# Altium schematic sheet Sheet1.SchDoc
size A4
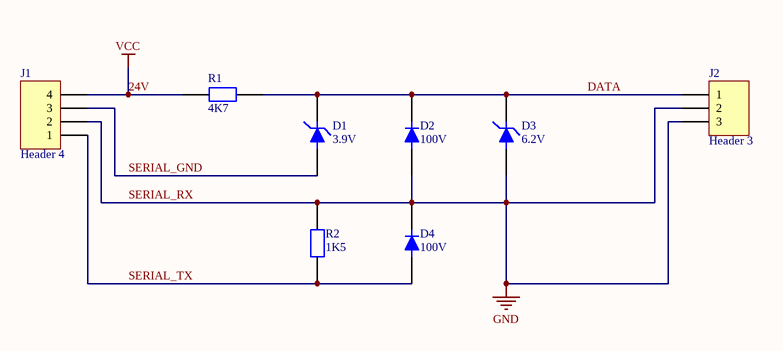
[diagram p0: Sheet1.SchDoc]

## Parts
D1  3.9V  [SOT23]
D2  100V  [SOT23]
D3  6.2V  [SOT23]
D4  100V  [SOT23]
J1  Header 4  [HDR1X4]
J2  Header 3  [PH_TERM_3]
R1  4K7  [RESC1608]
R2  1K5  [RESC1608]

## Nets
24V: J1.4 R1.1  [also labelled VCC]
SERIAL_RX: D2.1 D3.1 D4.3 J1.2 J2.2 J2.3 R2.2  [also labelled GND]
DATA: D1.3 D2.3 D3.3 J2.1 R1.2
SERIAL_GND: D1.1 J1.3
SERIAL_TX: D4.1 J1.1 R2.1

## Library data of the parts
D1 = BZX84C3V9LT1G: DIODE ZENER 3.9V 225MW SOT23-3; Manufacturer: ON Semiconductor; Tolerance: ±5%; Impedance (Max) (Zzt): 90 Ohm; Current - Reverse Leakage @ Vr: 3µA @ 1V; Voltage - Forward (Vf) (Max) @ If: 900mV @ 10mA; Supplier 1: Digi-Key; Manufacturer Part Number: BZX84C3V9LT1G; RoHS: RoHS Compliant; Category: Discrete Semiconductor Products; Stock 1: 20137; Pricing 1: 1=0.21, 10=0.188, 25=0.1708, 100=0.1232, 250=0.07256, 500=0.0602, 1000=0.04106 (AUD); Packaging: Cut Tape (CT); Voltage - Zener (Nom) (Vz): 3.9V; Power - Max: 225mW; Operating Temperature: -; Mounting Type: Surface Mount; Package / Case: TO-236-3, SC-59, SOT-23-3; Supplier Device Package: SOT-23-3 (TO-236); ComponentLink1URL: http://www.onsemi.com/pub_link/Collateral/BZX84C2V4LT1-D.PDF; ComponentLink1Description: http://www.onsemi.com/pub_link/Collateral/BZX84C2V4LT1-D.PDF; Supplier Part Number 1: BZX84C3V9LT1GOSCT-ND
D2 D4 = BAR46FILM: DIODE SCHOTTKY 100V 150MA SOT23; Manufacturer: STMicroelectronics; Current - Average Rectified (Io): 150mA (DC); Voltage - Forward (Vf) (Max) @ If: 1V @ 250mA; Speed: Small Signal =< 200mA (Io), Any Speed; Current - Reverse Leakage @ Vr: 5µA @ 75V; Capacitance @ Vr, F: 10pF @ 0V, 1MHz; Supplier 1: Digi-Key; Manufacturer Part Number: BAR46FILM; RoHS: RoHS Compliant; Category: Discrete Semiconductor Products; Stock 1: 2235; Pricing 1: 1=0.51, 10=0.296, 100=0.1274, 1000=0.09727 (AUD); Packaging: Digi-Reel®; Diode Type: Schottky; Voltage - DC Reverse (Vr) (Max): 100V; Reverse Recovery Time (trr): -; Mounting Type: Surface Mount; Package / Case: TO-236-3, SC-59, SOT-23-3; Supplier Device Package: SOT-23; Operating Temperature - Junction: 150°C (Max); ComponentLink1URL: http://www.st.com/web/en/resource/technical/document/datasheet/CD00000669.pdf; ComponentLink1Description: http://www.st.com/web/en/resource/technical/document/datasheet/CD00000669.pdf; Supplier Part Number 1: 497-12128-6-ND
D3 = BZX84C6V2LT1G: DIODE ZENER 6.2V 225MW SOT23-3; Manufacturer: ON Semiconductor; Tolerance: ±6%; Impedance (Max) (Zzt): 10 Ohm; Current - Reverse Leakage @ Vr: 3µA @ 4V; Voltage - Forward (Vf) (Max) @ If: 900mV @ 10mA; Supplier 1: Digi-Key; Manufacturer Part Number: BZX84C6V2LT1G; RoHS: RoHS Compliant; Category: Discrete Semiconductor Products; Stock 1: 23496; Pricing 1: 1=0.21, 10=0.188, 25=0.1708, 100=0.1232, 250=0.07256, 500=0.0602, 1000=0.04106 (AUD); Packaging: Cut Tape (CT); Voltage - Zener (Nom) (Vz): 6.2V; Power - Max: 225mW; Operating Temperature: -; Mounting Type: Surface Mount; Package / Case: TO-236-3, SC-59, SOT-23-3; Supplier Device Package: SOT-23-3 (TO-236); ComponentLink1URL: http://www.onsemi.com/pub_link/Collateral/BZX84C2V4LT1-D.PDF; ComponentLink1Description: http://www.onsemi.com/pub_link/Collateral/BZX84C2V4LT1-D.PDF; Supplier Part Number 1: BZX84C6V2LT1GOSCT-ND
J1 = Header 4: Header, 4-Pin; LatestRevisionDate: 17-Jul-2002; LatestRevisionNote: Re-released for DXP Platform.; Publisher: Altium Limited
J2 = Header 3: Header, 3-Pin; LatestRevisionDate: 17-Jul-2002; LatestRevisionNote: Re-released for DXP Platform.; Publisher: Altium Limited
R1 = RC0603FR-074K7L: RES SMD 4.7K OHM 1% 1/10W 0603; Manufacturer: Yageo; Power (Watts): 0.1W, 1/10W; Temperature Coefficient: ±100ppm/°C; Supplier 1: Digi-Key; Manufacturer Part Number: RC0603FR-074K7L; RoHS: RoHS Compliant; Category: Resistors; Stock 1: 3770438; Pricing 1: 1=0.15, 10=0.021, 25=0.0148, 100=0.0084, 250=0.0064, 500=0.0051, 1000=0.00377, 2500=0.00327 (AUD); Packaging: Cut Tape (CT); Resistance (Ohms): 4.7k; Tolerance: ±1%; Composition: Thick Film; Features: Moisture Resistant; Operating Temperature: -55°C ~ 155°C; Package / Case: 0603 (1608 Metric); Supplier Device Package: 0603; Size / Dimension: 0.063" L x 0.031" W (1.60mm x 0.80mm); Height: 0.022" (0.55mm); Number of Terminations: 2; ComponentLink1URL: http://www.yageo.com/NewPortal/yageodocoutput?fileName=/pdf/R-Chip/PYu-RC_Group_51_RoHS_L_3.pdf; ComponentLink1Description: http://www.yageo.com/NewPortal/yageodocoutput?fileName=/pdf/R-Chip/PYu-RC_Group_51_RoHS_L_3.pdf; Supplier Part Number 1: 311-4.70KHRCT-ND
R2 = RC0603FR-071K5L: RES SMD 1.5K OHM 1% 1/10W 0603; Manufacturer: Yageo; Power (Watts): 0.1W, 1/10W; Temperature Coefficient: ±100ppm/°C; Supplier 1: Digi-Key; Manufacturer Part Number: RC0603FR-071K5L; RoHS: RoHS Compliant; Category: Resistors; Stock 1: 1083027; Pricing 1: 1=0.15, 10=0.021, 25=0.0148, 100=0.0084, 250=0.0064, 500=0.0051, 1000=0.00377, 2500=0.00327 (AUD); Packaging: Cut Tape (CT); Resistance (Ohms): 1.5k; Tolerance: ±1%; Composition: Thick Film; Features: Moisture Resistant; Operating Temperature: -55°C ~ 155°C; Package / Case: 0603 (1608 Metric); Supplier Device Package: 0603; Size / Dimension: 0.063" L x 0.031" W (1.60mm x 0.80mm); Height: 0.022" (0.55mm); Number of Terminations: 2; ComponentLink1URL: http://www.yageo.com/NewPortal/yageodocoutput?fileName=/pdf/R-Chip/PYu-RC_Group_51_RoHS_L_3.pdf; ComponentLink1Description: http://www.yageo.com/NewPortal/yageodocoutput?fileName=/pdf/R-Chip/PYu-RC_Group_51_RoHS_L_3.pdf; Supplier Part Number 1: 311-1.50KHRCT-ND